# Altium schematic sheet iridium.SchDoc
size A
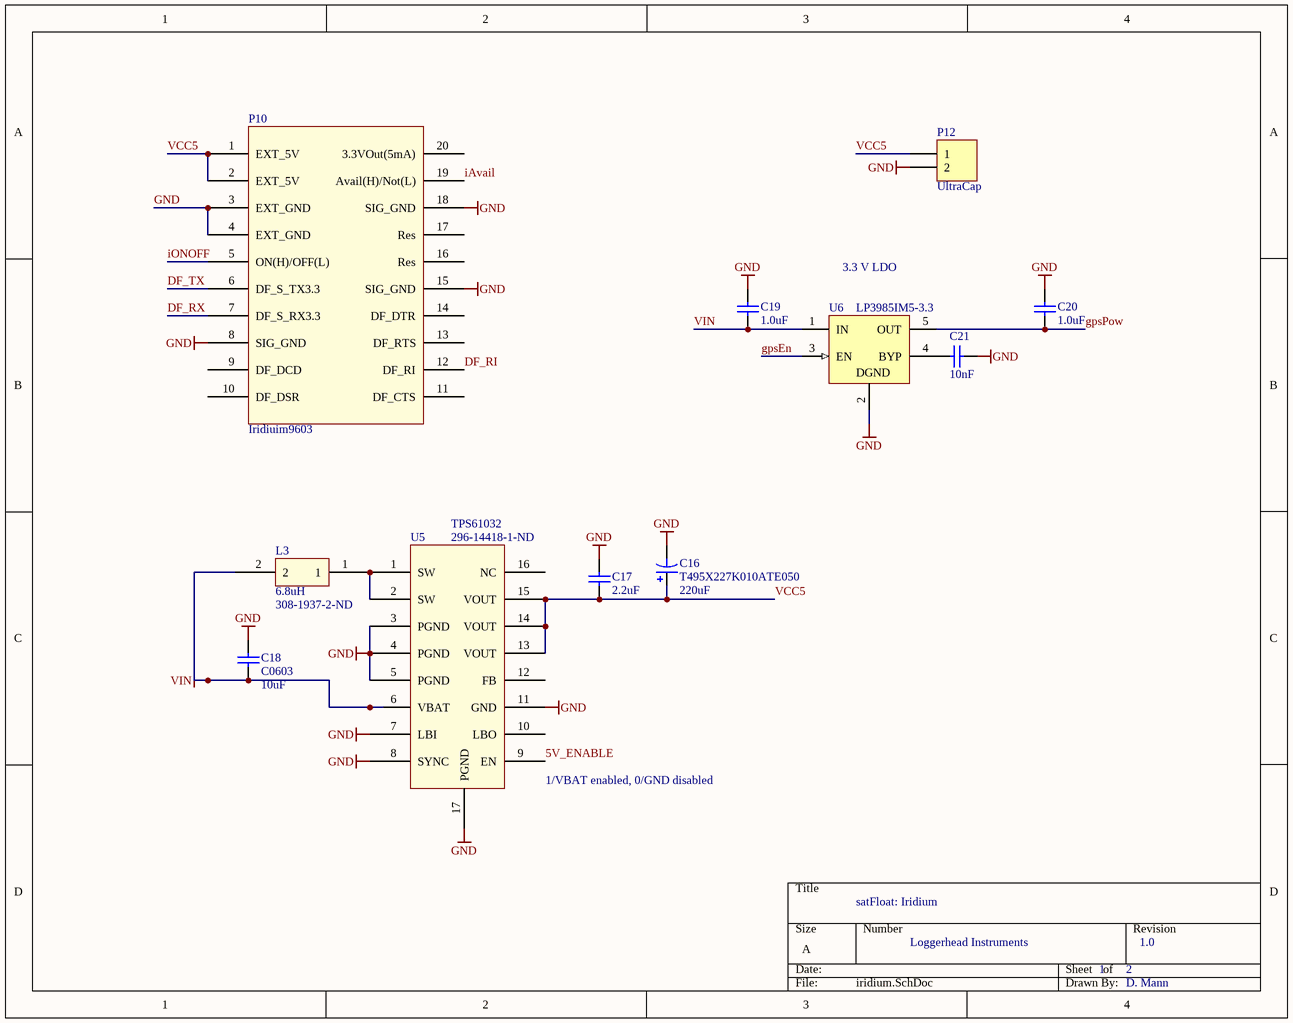
[diagram p0: iridium.SchDoc]

## Parts
C16  T495X227K010ATE050  value 220uF  [X]
C17  2.2uF  [0402]
C18  C0603  value 10uF  [0603]
C19  1.0uF  [0402]
C20  1.0uF  [0402]
C21  10nF  [0402]
L3  6.8uH  Supplier Part Number 1: 308-1937-2-ND  [Inductor - duplicate]
P10  Iridiuim9603  [Iridium9603]
P12  UltraCap  [HDR1X2]
U5  TPS61032  Supplier Part Number 2: 296-14418-1-ND  [TPS6103x]
U6  LP3985IM5-3.3  [MF05A_N]

## Nets
GND: C16.2 C17.2 C18.1 C19.2 C20.2 C21.1 P10.3(EXT_GND) P10.4(EXT_GND) P10.8(SIG_GND) P10.15(SIG_GND) P10.18(SIG_GND) P12.2 U5.3(PGND) U5.4(PGND) U5.5(PGND) U5.7(LBI) U5.8(SYNC) U5.11(GND) U5.17(PGND) U6.2(GND)
VIN: C18.2 C19.1 L3.2 U5.6(VBAT) U6.1(IN)
5V_ENABLE: U5.9(EN)
DF_RI: P10.12(DF_RI)
DF_RX: P10.7(DF_S_RX3.3)
DF_TX: P10.6(DF_S_TX3.3)
gpsEn: U6.3(EN)
gpsPow: C20.1 U6.5(OUT)
iAvail: P10.19(Avail(H)/Not(L))
iONOFF: P10.5(ON(H)/OFF(L))
VCC5: C16.1 C17.1 P10.1(EXT_5V) P10.2(EXT_5V) P12.1 U5.13(VOUT) U5.14(VOUT) U5.15(VOUT)
NetC21_2: C21.2 U6.4(BYP)
NetL3_1: L3.1 U5.1(SW) U5.2(SW)

Not connected (* = marked no-connect by the designer): P10 9(DF_DCD) 10(DF_DSR) 11(DF_CTS) 13(DF_RTS) 14(DF_DTR) 16(Res) 17(Res) 20(3.3VOut(5mA)); U5 10(LBO) 12(FB) 16(NC)

## Notes on the sheet
- 3.3 V LDO
- (near U5) 1/VBAT enabled, 0/GND disabled
- satFloat: Iridium
- Loggerhead Instruments
- 1
- 2
- 1.0
- D. Mann
- (in symbol LP3985IM5-3.3) DGND

## Library data of the parts
C16 = T495X: Solid Tantalum Chip Capacitor, Standard T495 Series - Low ESR, Surge Robust; PCB_Layout: Round Glue Pad at 2.9 ±0.1mm in diameter at KEMET's option; Published: 17-Jul-2002; LatestRevisionDate: 19-Mar-2004; LatestRevisionNote: Silkscreen dimensions re-sized.; DatasheetDocument: Mar-2001; PackageDocument: Mar-2001; PackageReference: X; Publisher: Altium Limited; Code_JEITA: 7343-43; ComponentLink1Description: Manufacturer Link; ComponentLink1URL: http://www.kemet.com/; ComponentLink2Description: Datasheet; ComponentLink2URL: http://www.kemet.com/kemet/web/homepage/kechome.nsf/vapubfilesname/F3102TA.pdf/$file/F3102TA.pdf
C17 = C0402: Ceramic Chip Capacitor - Standard; Note: Footprint corresponds to dimensions for bulk cassette packaging. This case size has tightened tolerances.; Published: 17-Jul-2002; LatestRevisionDate: 19-Mar-2004; LatestRevisionNote: Silkscreen size reduced.; DatasheetDocument: Mar-2001; PackageDocument: Mar-2001; PackageReference: 0402; Publisher: Altium Limited; Code_JEITA: 0402; Code_IPC: 1005 [0402]; ComponentLink1Description: Manufacturer Link; ComponentLink1URL: http://www.kemet.com/; ComponentLink2Description: Datasheet; ComponentLink2URL: http://www.kemet.com/kemet/web/homepage/kechome.nsf/vapubfilesname/F3102TA.pdf/$file/F3102TA.pdf; Value: 2.2uF
C18 = C0603: Ceramic Chip Capacitor - Standard; Note: Footprint corresponds to dimensions for bulk cassette packaging. This case size has tightened tolerances.; Published: 17-Jul-2002; LatestRevisionDate: 19-Mar-2004; LatestRevisionNote: Silkscreen size reduced.; DatasheetDocument: Mar-2001; PackageDocument: Mar-2001; PackageReference: 0603; Publisher: Altium Limited; Code_JEITA: 0603; Code_IPC: 1608 [0603]; ComponentLink1Description: Manufacturer Link; ComponentLink1URL: http://www.kemet.com/; ComponentLink2Description: Datasheet; ComponentLink2URL: http://www.kemet.com/kemet/web/homepage/kechome.nsf/vapubfilesname/F3102TA.pdf/$file/F3102TA.pdf
C19-C21 = C0402: Ceramic Chip Capacitor - Standard; Note: Footprint corresponds to dimensions for bulk cassette packaging. This case size has tightened tolerances.; Value: 0.1uF; Published: 17-Jul-2002; LatestRevisionDate: 19-Mar-2004; LatestRevisionNote: Silkscreen size reduced.; DatasheetDocument: Mar-2001; PackageDocument: Mar-2001; PackageReference: 0402; Publisher: Altium Limited; Code_JEITA: 0402; Code_IPC: 1005 [0402]; ComponentLink1Description: Manufacturer Link; ComponentLink1URL: http://www.kemet.com/; ComponentLink2Description: Datasheet; ComponentLink2URL: http://www.kemet.com/kemet/web/homepage/kechome.nsf/vapubfilesname/F3102TA.pdf/$file/F3102TA.pdf
L3 = Inductor 6.8uH: Sumida Inductor; Supplier 1: Digi-Key
P10 = IRIDIUM9603
P12 = Header 2: Header, 2-Pin; LatestRevisionDate: 17-Jul-2002; LatestRevisionNote: Re-released for DXP Platform.; Publisher: Altium Limited
U5 = TPS6103x: Boost converter; Supplier 1: Newark; Supplier 2: Digi-Key
U6 = LP3985IM5-3.3: Micropower, 150mA Low-Noise Ultra Low-Dropout CMOS Voltage Regulator; Manufacturer: National Semiconductor; CompType: LDO IC; PackageTopMarking: LDQB*XTT; PowerWise: N; Published: 4-Dec-2008; DatasheetVersion: Aug-2005; PackageVersion: revD, Aug-2008; PackageReference: MF05A; Publisher: Altium Limited; PackageDescription: Molded SOT-23, .115 x .063 x .040 in Body, 5 Lead, .0375 in Pitch; PartNumber: LP3985IM5-3.3; RoHS: O; PinCount: 5; DigiKeyPartNumber: LP3985IM5-3.3CT-ND; ComponentLink1Description: LP3985 Datasheet; ComponentLink1URL: http://www.national.com/ds/LP/LP3985.pdf; ComponentLink2Description: LP3985 Web Page; ComponentLink2URL: http://www.national.com/pf/LP/LP3985.html; ComponentLink3Description: MF05A Package Page; ComponentLink3URL: http://www.national.com/packaging/folders/mf05a.html